# EAGLE design interruptorcontrolado (EAGLE 7.4.0)
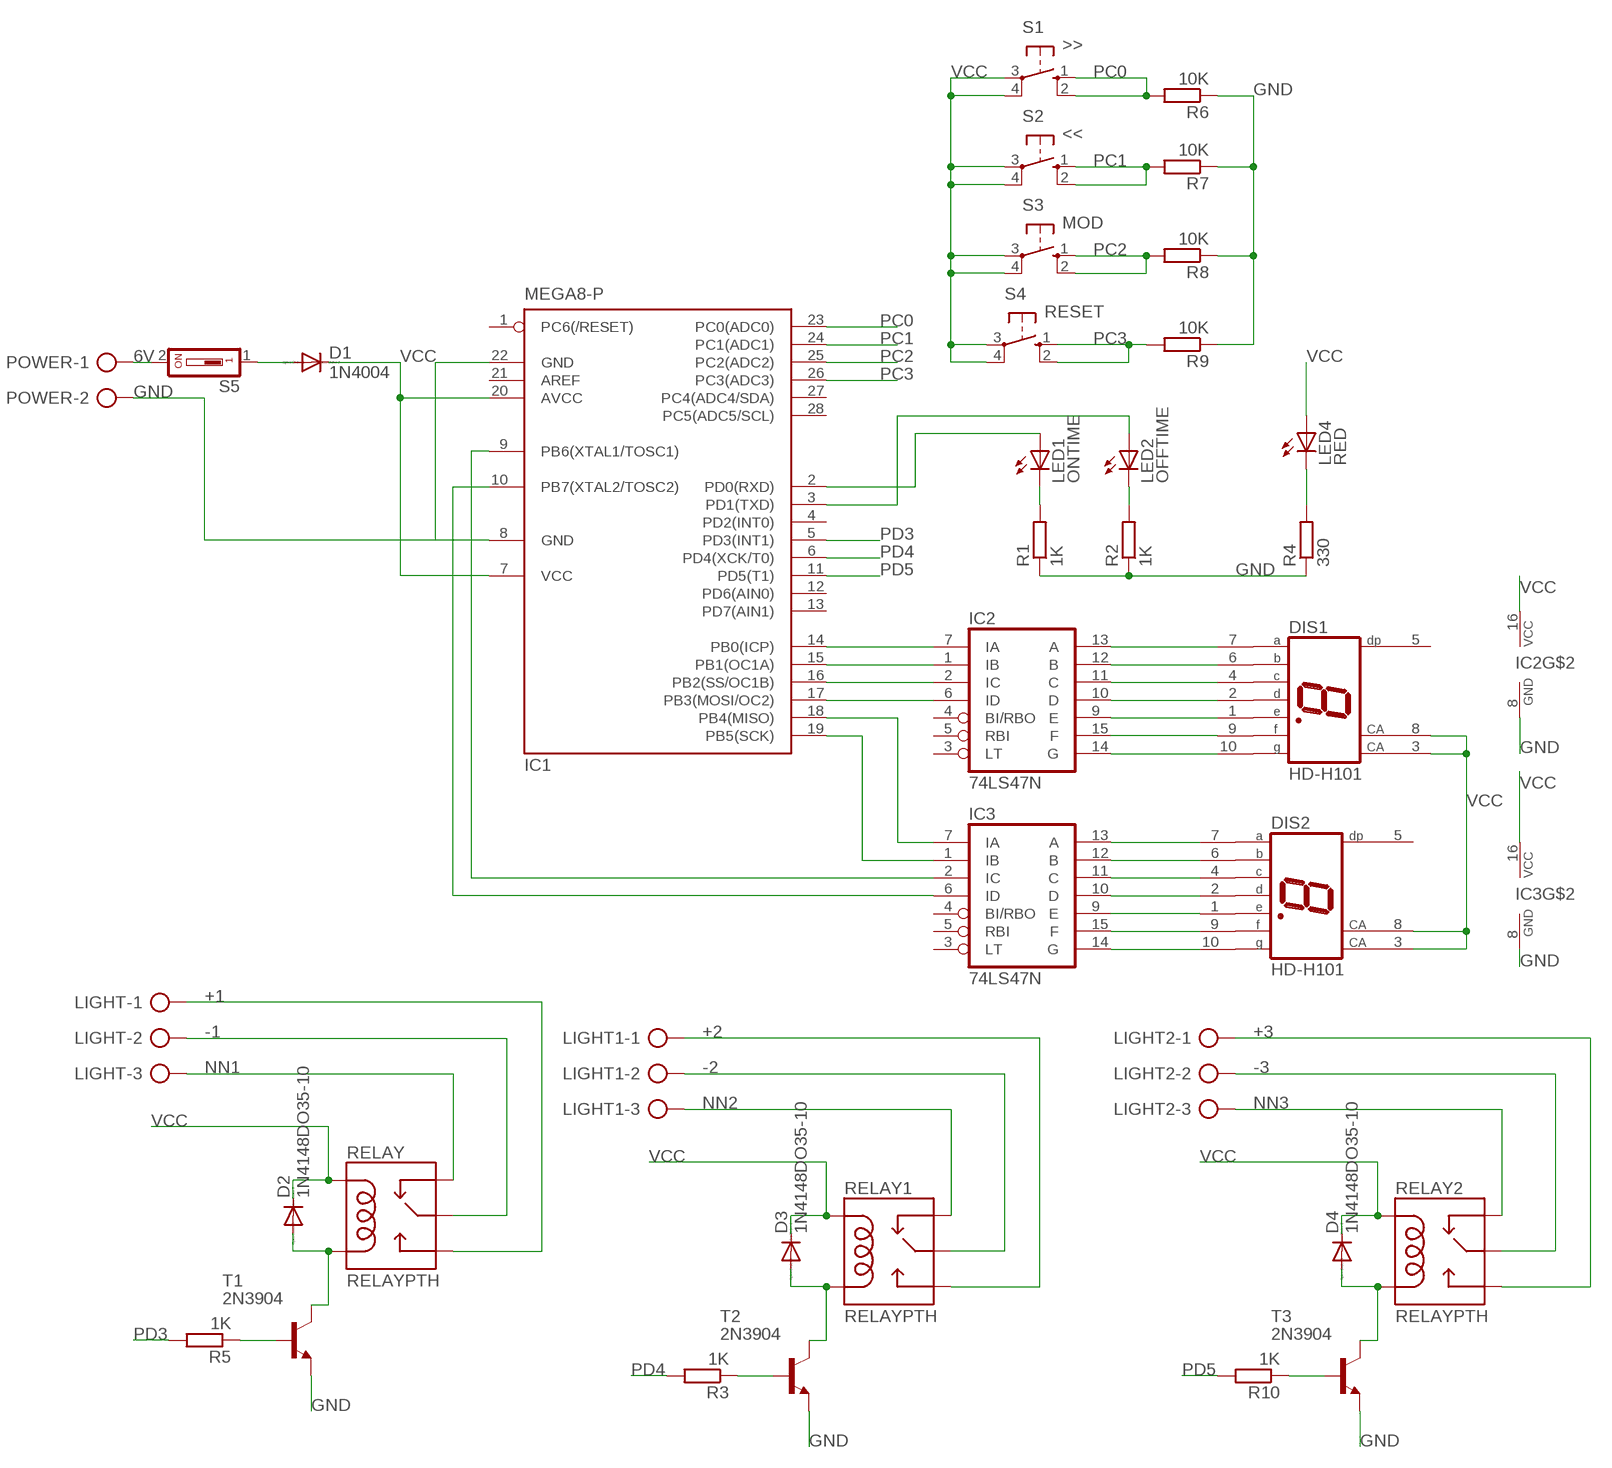
[diagram p0: schematic, sheet 1]

## Parts
D1  1N4004  [DO41-10]
D2  1N4148DO35-10  [DO35-10]
D3  1N4148DO35-10  [DO35-10]
D4  1N4148DO35-10  [DO35-10]
DIS1  HD-H101  [HDSP-M]
DIS2  HD-H101  [HDSP-M]
IC1  MEGA8-P  [DIL28-3]
IC2  74LS47N  [DIL16]
IC3  74LS47N  [DIL16]
LED1  ONTIME  LED5MM  [LED5MM]
LED2  OFFTIME  LED5MM  [LED5MM]
LED4  RED  LED5MM  [LED5MM]
LIGHT  AK500/3  [AK500/3]
LIGHT1  AK500/3  [AK500/3]
LIGHT2  AK500/3  [AK500/3]
POWER  AK500/2  [AK500/2]
R1  1K  R-EU_0207/10  [0207/10]
R2  1K  R-EU_0207/10  [0207/10]
R3  1K  R-EU_0207/10  [0207/10]
R4  330  R-EU_0207/10  [0207/10]
R5  1K  R-EU_0207/10  [0207/10]
R6  10K  R-EU_0207/10  [0207/10]
R7  10K  R-EU_0207/10  [0207/10]
R8  10K  R-EU_0207/10  [0207/10]
R9  10K  R-EU_0207/10  [0207/10]
R10  1K  R-EU_0207/10  [0207/10]
RELAY  RELAYPTH  [SRD-05VDC-SL-C]
RELAY1  RELAYPTH  [SRD-05VDC-SL-C]
RELAY2  RELAYPTH  [SRD-05VDC-SL-C]
S1  >>  10-XX  [B3F-10XX]
S2  <<  10-XX  [B3F-10XX]
S3  MOD  10-XX  [B3F-10XX]
S4  RESET  10-XX  [B3F-10XX]
S5  SD4-01  [SD4-01]
T1  2N3904  [TO92]
T2  2N3904  [TO92]
T3  2N3904  [TO92]

## Nets
6V: POWER.1 S5.2
+1: LIGHT.1 RELAY.SWOPEN
+2: LIGHT1.1 RELAY1.SWOPEN
+3: LIGHT2.1 RELAY2.SWOPEN
-1: LIGHT.2 RELAY.SWCOMMON
-2: LIGHT1.2 RELAY1.SWCOMMON
-3: LIGHT2.2 RELAY2.SWCOMMON
GND: IC1.8(GND) IC1.22(GND) IC2.8(GND) IC3.8(GND) POWER.2 R1.1 R2.1 R4.1 R6.1 R7.1 R8.1 R9.1 T1.3(E) T2.3(E) T3.3(E)
N$1: IC1.14(PB0(ICP)) IC2.7(IA)
N$2: IC1.15(PB1(OC1A)) IC2.1(IB)
N$3: IC1.16(PB2(SS/OC1B)) IC2.2(IC)
N$4: IC1.17(PB3(MOSI/OC2)) IC2.6(ID)
N$5: IC1.18(PB4(MISO)) IC3.7(IA)
N$6: IC1.19(PB5(SCK)) IC3.1(IB)
N$7: IC1.9(PB6(XTAL1/TOSC1)) IC3.2(IC)
N$8: IC1.10(PB7(XTAL2/TOSC2)) IC3.6(ID)
N$9: DIS1.7(A) IC2.13(A)
N$10: DIS1.6(B) IC2.12(B)
N$11: DIS1.4(C) IC2.11(C)
N$12: DIS1.2(D) IC2.10(D)
N$13: DIS1.1(E) IC2.9(E)
N$14: DIS1.9(F) IC2.15(F)
N$15: DIS1.10(G) IC2.14(G)
N$16: DIS2.7(A) IC3.13(A)
N$17: DIS2.6(B) IC3.12(B)
N$18: DIS2.4(C) IC3.11(C)
N$19: DIS2.2(D) IC3.10(D)
N$20: DIS2.1(E) IC3.9(E)
N$21: DIS2.9(F) IC3.15(F)
N$22: DIS2.10(G) IC3.14(G)
N$23: LED1.K(C) R1.2
N$24: LED2.K(C) R2.2
N$25: R3.1 T2.2(B)
N$26: LED4.K(C) R4.2
N$27: IC1.2(PD0(RXD)) LED1.A
N$28: IC1.3(PD1(TXD)) LED2.A
N$29: D3.A RELAY1.COIL0 T2.1(C)
N$30: R5.1 T1.2(B)
N$31: D2.A RELAY.COIL0 T1.1(C)
N$32: R10.1 T3.2(B)
N$33: D1.A S5.1
N$34: D4.A RELAY2.COIL0 T3.1(C)
NN1: LIGHT.3 RELAY.SWCLOSED(SWCLOSE)
NN2: LIGHT1.3 RELAY1.SWCLOSED(SWCLOSE)
NN3: LIGHT2.3 RELAY2.SWCLOSED(SWCLOSE)
PC0: IC1.23(PC0(ADC0)) R6.2 S1.1(S) S1.2(S1)
PC1: IC1.24(PC1(ADC1)) R7.2 S2.1(S) S2.2(S1)
PC2: IC1.25(PC2(ADC2)) R8.2 S3.1(S) S3.2(S1)
PC3: IC1.26(PC3(ADC3)) R9.2 S4.1(S) S4.2(S1)
PD3: IC1.5(PD3(INT1)) R5.2
PD4: IC1.6(PD4(XCK/T0)) R3.2
PD5: IC1.11(PD5(T1)) R10.2
VCC: D1.C D2.C D3.C D4.C DIS1.3(CA) DIS1.8(CA) DIS2.3(CA) DIS2.8(CA) IC1.7(VCC) IC1.20(AVCC) IC2.16(VCC) IC3.16(VCC) LED4.A RELAY1.COIL1 RELAY2.COIL1 RELAY.COIL1 S1.3(P) S1.4(P1) S2.3(P) S2.4(P1) S3.3(P) S3.4(P1) S4.3(P) S4.4(P1)
Unconnected: DIS1.5(DP) DIS2.5(DP) IC1.1(PC6(/RESET)) IC1.4(PD2(INT0)) IC1.12(PD6(AIN0)) IC1.13(PD7(AIN1)) IC1.21(AREF) IC1.27(PC4(ADC4/SDA)) IC1.28(PC5(ADC5/SCL)) IC2.3(LT) IC2.4(BI/RBO) IC2.5(RBI) IC3.3(LT) IC3.4(BI/RBO) IC3.5(RBI)

## Library data of the parts
D1 = diode:1N4004: DIODE general purpose rectifier, 1 A
D2-D4 = diode:1N4148: DIODE high speed (Philips)
DIS1 DIS2 = display-hp:HD-H101: LED DISPLAY 1-character 7 segment, decimal point right; OC_FARNELL: unknown; OC_NEWARK: unknown
IC1 = atmel:MEGA8-P: MICROCONTROLLER 8 Kbytes FLASH, 1 kbytes SRAM, 512 bytes EEPROM, USART, 4-channel 10 bit ADC, 2-channel 8 bit ADC Pin compatible with Atmega48, ATMega88, ATMega168 Source: avr.lbr; OC_FARNELL: unknown; OC_NEWARK: unknown
IC2 IC3 = 74xx-eu:74*47: BCD to seven segment DECODER/DRIVER Source: http://www.ee.washington.edu/stores/DataSheets/74ls/74ls47.pdf
LED1 LED2 LED4 = led:LED: LED OSRAM: - CHIPLED LG R971, LG N971, LY N971, LG Q971, LY Q971, LO R971, LY R971 LH N974, LH R974 LS Q976, LO Q976, LY Q976 LO Q996 - Hyper CHIPLED LW Q18S LB Q993, LB Q99A, LB R99A - SideLED LS A670, LO A670, LY A670, LG A670, LP A670 LB A673, LV A673, LT A673, LW A673 LH A674 LY A675 LS A676, LA A676, LO A676, LY A676, LW A676 LS A679, LY A679, LG A679 - Hyper Micro SIDELED® LS Y876, LA Y876, LO Y876, LY Y876 LT Y87S - SmartLED LW L88C, LW L88S LB L89C, LB L89S, LG L890 LS L89K, LO L89K, LY L89K LS L896, LA L896, LO L896, LY L896 - TOPLED LS T670, LO T670, LY T670, LG T670, LP T670 LSG T670, LSP T670, LSY T670, LOP T670, LYG T670 LG T671, LOG T671, LSG T671 LB T673, LV T673, LT T673, LW T673 LH T674 LS T676, LA T676, LO T676, LY T676, LB T676, LH T676, LSB T676, LW T676 LB T67C, LV T67C, LT T67C, LS T67K, LO T67K, LY T67K, LW E67C LS E67B, LA E67B, LO E67B, LY E67B, LB E67C, LV E67C, LT E67C LW T67C LS T679, LY T679, LG T679 LS T770, LO T770, LY T770, LG T770, LP T770 LB T773, LV T773, LT T773, LW T773 LH T774 LS E675, LA E675, LY E675, LS T675 LS T776, LA T776, LO T776, LY T776, LB T776 LHGB T686 LT T68C, LB T68C - Hyper Mini TOPLED® LB M676 - Mini TOPLED Santana® LG M470 LS M47K, LO M47K, LY M47K Source: http://www.osram.convergy.de LUXEON: - LUMILED® LXK2-PW12-R00, LXK2-PW12-S00, LXK2-PW14-U00, LXK2-PW14-V00 LXK2-PM12-R00, LXK2-PM12-S00, LXK2-PM14-U00 LXK2-PE12-Q00, LXK2-PE12-R00, LXK2-PE12-S00, LXK2-PE14-T00, LXK2-PE14-U00 LXK2-PB12-K00, LXK2-PB12-L00, LXK2-PB12-M00, LXK2-PB14-N00, LXK2-PB14-P00, LXK2-PB14-Q00 LXK2-PR12-L00, LXK2-PR12-M00, LXK2-PR14-Q00, LXK2-PR14-R00 LXK2-PD12-Q00, LXK2-PD12-R00, LXK2-PD12-S00 LXK2-PH12-R00, LXK2-PH12-S00 LXK2-PL12-P00, LXK2-PL12-Q00, LXK2-PL12-R00 Source: www.luxeon.com KINGBRIGHT: KA-3528ASYC Source: www.kingbright.com
LIGHT LIGHT1 LIGHT2 = con-ptr500:AK500/3: CONNECTOR; OC_FARNELL: unknown; OC_NEWARK: unknown
POWER = con-ptr500:AK500/2: CONNECTOR; OC_FARNELL: unknown; OC_NEWARK: unknown
R1-R10 = resistor:R-EU_: RESISTOR, European symbol
RELAY RELAY1 RELAY2 = RELAYino:RELAY: SPDT relay (COM-00101)
S1-S4 = switch-omron:10-XX: OMRON SWITCH; MPN: B3F-1000; OC_FARNELL: 176432; OC_NEWARK: 36M3542
S5 = switch-dil:SD4-01: DIL/CODE SWITCH; OC_FARNELL: unknown; OC_NEWARK: unknown
T1-T3 = transistor:2N3904: NPN TRANSISTOR

## Board
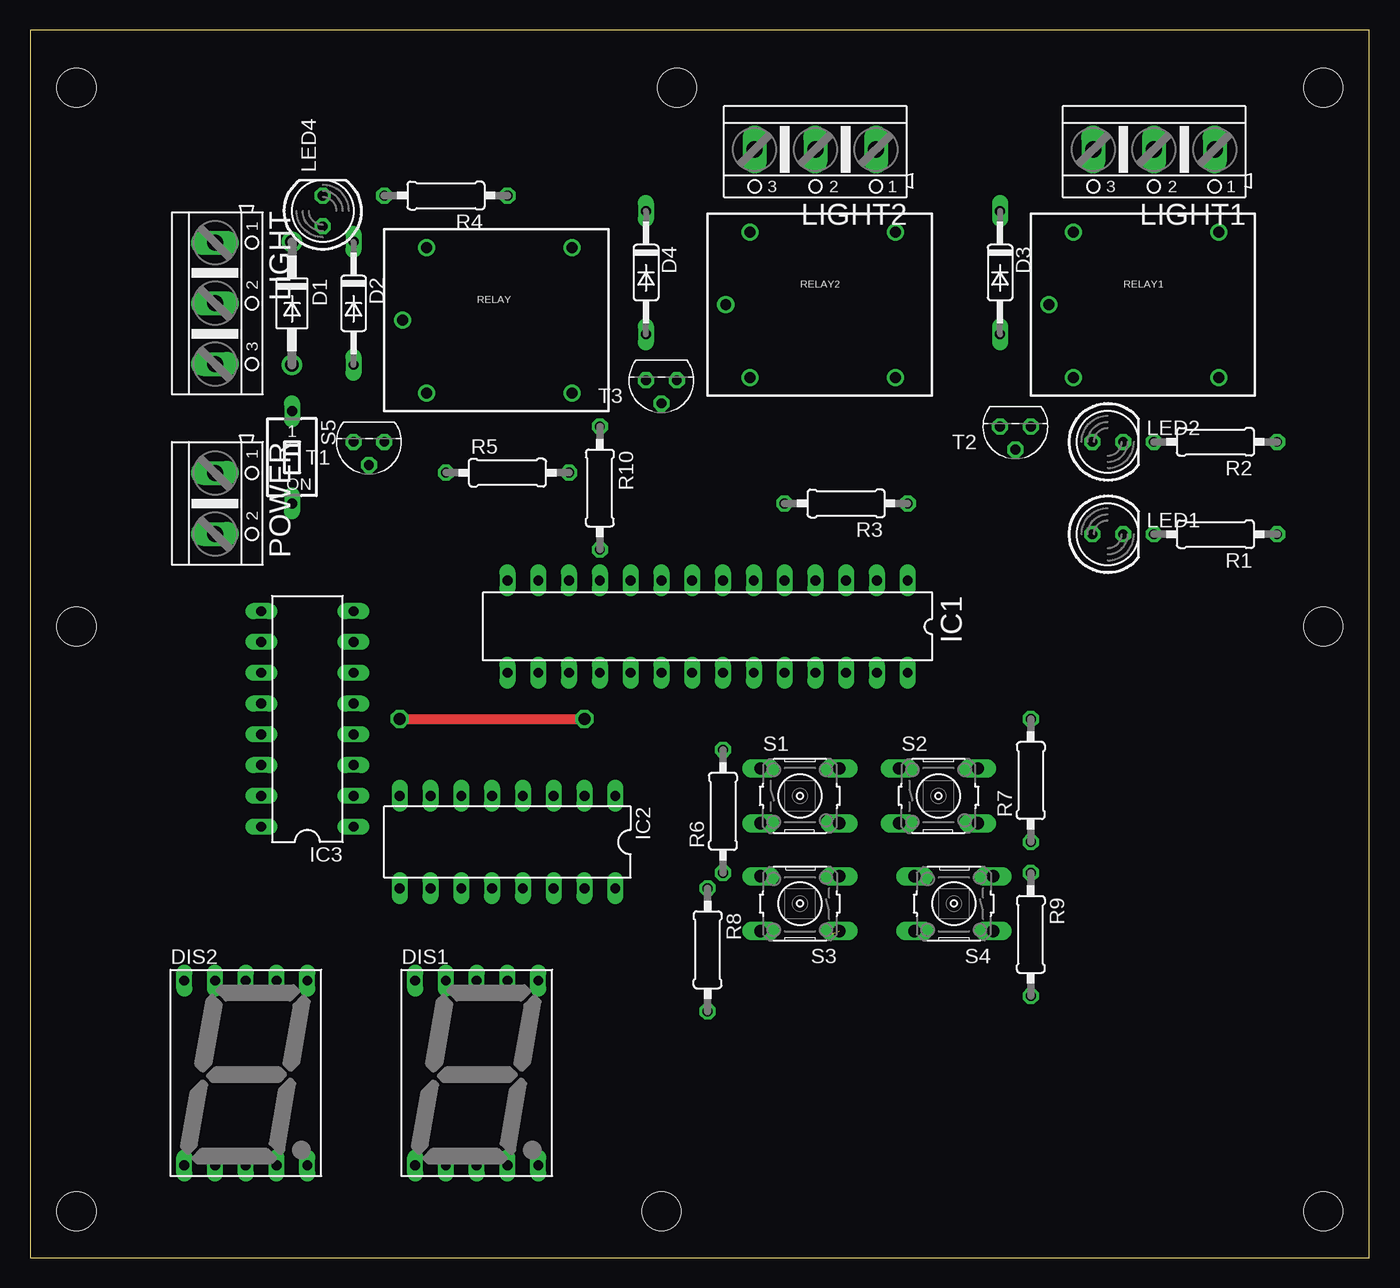
[diagram p1: board, top side]
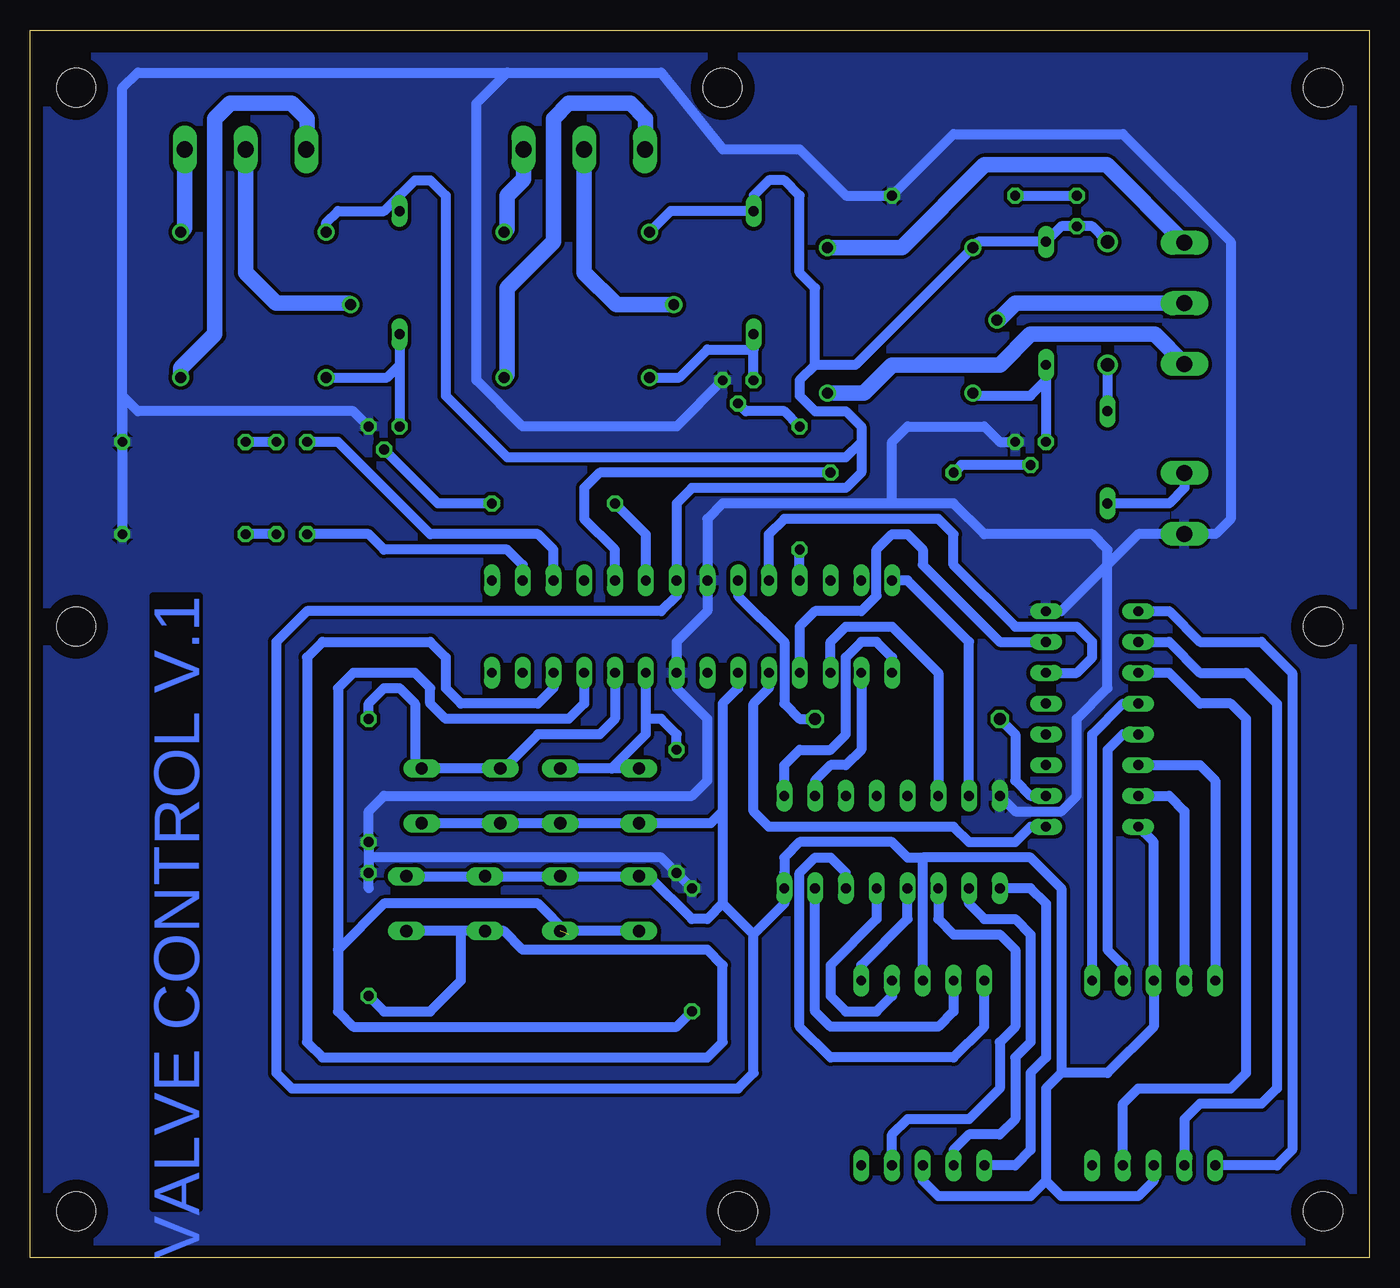
[diagram p2: board, bottom side, seen from below]

Size 110.47 x 101.27 mm. Coordinates in mm from the lower left corner, seen from the top.
Outline: 0,0 110.47,0 110.47,101.27 0,101.27 0,0
Copper layers (1*16): Top 0.035mm / dielectric 1.5mm / Bottom 0.035mm
Design rules "default *": minimum track width 10mil, minimum drill 24mil, track to track 12mil, track to pad 8mil, pad to pad 8mil, via to via 12mil, smd to smd 8mil, copper to edge 40mil, drill to drill 8mil, minimum pad ring 10mil, minimum via ring 8mil, stop-mask expansion 4mil, vias tented up to drill 0mil, thermal gap 10mil
Holes 3.2 mm at 3.81,96.52 106.68,96.52 53.34,96.52 3.81,3.81 52.07,3.81 106.68,3.81 3.81,52.07 106.68,52.07

### Footprints (pad centres in the part's own frame; a part is rotated, then mirrored left to right if it is on the bottom)
DO41-10 = drill 1.118: A 5.08,0; C -5.08,0
DO35-10 = drill 0.813 long: A 5.08,0; C -5.08,0
HDSP-M = drill 0.813 long: 1 -5.08,-7.62; 2 -2.54,-7.62; 3 0,-7.62; 4 2.54,-7.62; 5 5.08,-7.62; 6 5.08,7.62; 7 2.54,7.62; 8 0,7.62; 9 -2.54,7.62; 10 -5.08,7.62
DIL28-3 = drill 0.813 long: 1 -16.51,-3.81; 2 -13.97,-3.81; 3 -11.43,-3.81; 4 -8.89,-3.81; 5 -6.35,-3.81; 6 -3.81,-3.81; 7 -1.27,-3.81; 8 1.27,-3.81; 9 3.81,-3.81; 10 6.35,-3.81; 11 8.89,-3.81; 12 11.43,-3.81; 13 13.97,-3.81; 14 16.51,-3.81; 15 16.51,3.81; 16 13.97,3.81; 17 11.43,3.81; 18 8.89,3.81; 19 6.35,3.81; 20 3.81,3.81; 21 1.27,3.81; 22 -1.27,3.81; 23 -3.81,3.81; 24 -6.35,3.81; 25 -8.89,3.81; 26 -11.43,3.81; 27 -13.97,3.81; 28 -16.51,3.81
DIL16 = drill 0.813 long: 1 -8.89,-3.81; 2 -6.35,-3.81; 3 -3.81,-3.81; 4 -1.27,-3.81; 5 1.27,-3.81; 6 3.81,-3.81; 7 6.35,-3.81; 8 8.89,-3.81; 9 8.89,3.81; 10 6.35,3.81; 11 3.81,3.81; 12 1.27,3.81; 13 -1.27,3.81; 14 -3.81,3.81; 15 -6.35,3.81; 16 -8.89,3.81
LED5MM = drill 0.813 octagon: A -1.27,0; K 1.27,0
AK500/3 = drill 1.321 long: 1 -5.004,0; 2 0,0; 3 5.004,0
AK500/2 = drill 1.321 long: 1 -2.515,0; 2 2.515,0
0207/10 = drill 0.813 octagon: 1 -5.08,0; 2 5.08,0
SRD-05VDC-SL-C = drill 0.9: COIL0 -5.39,-6.12; COIL1 -5.39,5.88; SWCLOSED 6.61,-6.12; SWCOMMON -7.39,-0.12; SWOPEN 6.61,5.88
B3F-10XX = drill 1.016 long: 1 -3.251,2.261; 2 3.251,2.261; 3 -3.251,-2.261; 4 3.251,-2.261
SD4-01 = drill 0.813 long: 1 0,-3.81; 2 0,3.81
TO92 = drill 0.813 octagon: 1 1.27,0; 2 0,1.905; 3 -1.27,0

### Placement (x,y rotation side)
D1  21.59,78.74 270 top
D2  26.67,78.74 270 top
D3  80.01,81.28 270 top
D4  50.8,81.28 270 top
DIS1  36.83,15.24 0 top
DIS2  17.78,15.24 0 top
IC1  55.88,52.07 180 top
IC2  39.37,34.29 180 top
IC3  22.86,44.45 90 top
LED1  88.9,59.69 0 top
LED2  88.9,67.31 0 top
LED4  24.13,86.36 90 top
LIGHT  15.24,78.74 270 top
LIGHT1  92.71,91.44 180 top
LIGHT2  64.77,91.44 180 top
POWER  15.24,62.23 270 top
R1  97.79,59.69 180 top
R2  97.79,67.31 180 top
R3  67.31,62.23 180 top
R4  34.29,87.63 180 top
R5  39.37,64.77 0 top
R6  57.15,36.83 90 top
R7  82.55,39.37 90 top
R8  55.88,25.4 270 top
R9  82.55,26.67 270 top
R10  46.99,63.5 270 top
RELAY  38.1,77.47 0 top
RELAY1  91.44,78.74 0 top
RELAY2  64.77,78.74 0 top
S1  63.5,38.1 0 top
S2  74.93,38.1 0 top
S3  63.5,29.21 180 top
S4  76.2,29.21 180 top
S5  21.59,66.04 180 top
T1  27.94,67.31 180 top
T2  81.28,68.58 180 top
T3  52.07,72.39 180 top

### Tracks (layer width: path | path; a pad name or v marks a point on that pad's centre or on a via)
6V
  Bottom 0.813: POWER.1 15.24,63.5 16.51,62.23 S5.2
+1
  Bottom 1.27: LIGHT.1 21.67,90.17 31.75,90.17 38.57,83.35 RELAY.SWOPEN
+2
  Bottom 1.27: LIGHT1.1 97.71,84.96 RELAY1.SWOPEN
+3
  Bottom 1.27: LIGHT2.1 69.77,88.98 71.12,87.63 71.12,84.88 RELAY2.SWOPEN
-1
  Bottom 1.27: LIGHT.2 29.21,78.74 30.6,77.35 RELAY.SWCOMMON
-2
  Bottom 1.27: LIGHT1.2 92.71,81.28 90.17,78.74 84.17,78.74 RELAY1.SWCOMMON
-3
  Bottom 1.27: RELAY2.SWCOMMON 62.11,78.62 64.77,81.28 LIGHT2.2
GND
  Bottom 0.813: R2.1 R1.1 | 39.37,62.23 39.37,67.31 38.1,68.58 31.75,68.58 30.48,67.31 T1.3 | 82.55,33.02 R7.1 82.55,36.83 81.28,38.1 55.88,38.1 54.61,39.37 54.61,44.45 57.15,46.99 IC1.22 57.15,50.8 54.61,53.34 IC1.8 54.61,60.96 53.34,62.23 39.37,62.23 | 82.55,33.02 R9.1 82.55,30.48 | R8.1 R6.1 58.42,33.02 82.55,33.02 | 21.59,57.15 25.4,53.34 IC3.8 | IC2.8 29.21,36.83 25.4,36.83 24.13,38.1 24.13,44.45 21.59,46.99 21.59,57.15 | 21.59,57.15 19.05,59.69 15.27,59.69 POWER.2 12.68,59.72 11.43,60.96 11.43,83.82 20.32,92.71 34.29,92.71 R4.1 43.18,87.63 46.99,91.44 53.34,91.44 58.42,97.79 71.12,97.79 | 21.59,57.15 21.59,58.42 22.86,59.69 31.75,59.69 34.29,62.23 39.37,62.23 | T2.3 83.82,69.85 101.6,69.85 102.87,71.12 R2.1 | R2.1 102.87,96.52 101.6,97.79 71.12,97.79 | T3.3 57.15,68.58 69.85,68.58 73.66,72.39 73.66,95.25 71.12,97.79
  pour Bottom: 1.27,99.06 1.27,1.27 109.22,1.27 109.22,99.06
N$1
  Bottom 0.813: IC2.7 33.02,50.8 38.1,55.88 IC1.14
N$2
  Bottom 0.813: IC1.15 39.37,49.53 40.64,50.8 41.91,50.8 43.18,49.53 43.18,43.18 44.45,41.91 46.99,41.91 48.26,40.64 IC2.1
N$3
  Bottom 0.813: IC1.16 41.91,41.91 43.18,40.64 44.45,40.64 45.72,39.37 IC2.2
N$4
  Bottom 0.813: IC1.17 44.45,50.8 43.18,52.07 39.37,52.07 35.56,48.26 IC2.6
N$5
  Bottom 0.813: IC3.7 30.48,50.8 36.83,57.15 36.83,58.42 38.1,59.69 39.37,59.69 40.64,58.42 40.64,54.61 41.91,53.34 45.72,53.34 46.99,52.07 IC1.18
N$6
  Bottom 0.813: IC3.1 27.94,35.56 29.21,34.29 33.02,34.29 34.29,35.56 49.53,35.56 50.8,36.83 50.8,45.72 49.53,46.99 IC1.19
N$7  (via drill 1)
  Top 0.813: v30.48,44.45 v45.72,44.45
  Bottom 0.813: v30.48,44.45 29.21,43.18 29.21,39.37 27.94,38.1 IC3.2 | IC1.9 52.07,54.61 48.26,50.8 48.26,45.72 46.99,44.45 v45.72,44.45
N$8
  Bottom 0.813: IC1.10 49.53,59.69 48.26,60.96 35.56,60.96 34.29,59.69 34.29,57.15 29.21,52.07 24.13,52.07 22.86,50.8 22.86,49.53 24.13,48.26 IC3.6
N$9
  Bottom 0.813: DIS1.7 39.37,21.59 40.64,20.32 43.18,20.32 44.45,21.59 44.45,24.13 40.64,27.94 IC2.13
N$10
  Bottom 0.813: DIS1.6 41.91,24.13 38.1,27.94 IC2.12
N$11
  Bottom 0.813: IC2.11 35.56,27.94 34.29,26.67 30.48,26.67 29.21,25.4 29.21,19.05 30.48,17.78 30.48,13.97 33.02,11.43 38.1,11.43 39.37,10.16 DIS1.4
N$12
  Bottom 0.813: IC2.10 33.02,29.21 31.75,27.94 29.21,27.94 27.94,26.67 27.94,17.78 29.21,16.51 29.21,11.43 30.48,10.16 33.02,10.16 34.29,8.89 DIS1.2
N$13
  Bottom 0.813: IC2.9 27.94,30.48 26.67,29.21 26.67,16.51 27.94,15.24 27.94,8.89 29.21,7.62 DIS1.1
N$14
  Bottom 0.813: IC2.15 45.72,20.32 44.45,19.05 35.56,19.05 34.29,20.32 DIS1.9
N$15
  Bottom 0.813: IC2.14 43.18,31.75 44.45,33.02 45.72,33.02 46.99,31.75 46.99,19.05 44.45,16.51 34.29,16.51 31.75,19.05 DIS1.10
N$16
  Bottom 0.813: IC3.13 20.32,43.18 21.59,41.91 21.59,25.4 20.32,24.13 DIS2.7
N$17
  Bottom 0.813: DIS2.6 22.86,43.18 20.32,45.72 IC3.12
N$18
  Bottom 0.813: DIS2.4 20.32,12.7 19.05,13.97 11.43,13.97 10.16,15.24 10.16,44.45 11.43,45.72 13.97,45.72 16.51,48.26 IC3.11
N$19
  Bottom 0.813: IC3.10 16.51,50.8 13.97,48.26 10.16,48.26 7.62,45.72 7.62,13.97 8.89,12.7 13.97,12.7 15.24,11.43 DIS2.2
N$20
  Bottom 0.813: IC3.9 16.51,53.34 13.97,50.8 8.89,50.8 6.35,48.26 6.35,8.89 7.62,7.62 DIS2.1
N$21
  Bottom 0.813: IC3.15 16.51,38.1 15.24,36.83 DIS2.9
N$22
  Bottom 0.813: IC3.14 13.97,40.64 12.7,39.37 DIS2.10
N$23
  Bottom 0.813: LED1.K R1.2
N$24
  Bottom 0.813: LED2.K R2.2
N$25
  Bottom 0.813: R3.1 76.83,62.23 T2.2
N$26
  Bottom 0.813: R4.2 LED4.K
N$27
  Bottom 0.813: IC1.2 69.85,57.15 71.12,58.42 81.28,58.42 82.55,59.69 LED1.A
N$28
  Bottom 0.813: IC1.3 67.31,58.42 68.58,59.69 77.47,59.69 85.09,67.31 LED2.A
N$29
  Bottom 0.813: D3.A 80.01,73.66 | 80.01,73.66 T2.1 | RELAY1.COIL0 81.05,72.62 80.01,73.66
N$30
  Bottom 0.813: T1.2 33.66,65.41 R5.1
N$31
  Bottom 0.813: D2.A 26.67,72.39 | 26.67,72.39 T1.1 | RELAY.COIL0 32.48,71.12 27.94,71.12 26.67,72.39
N$32
  Bottom 0.813: R10.1 48.26,69.85 51.44,69.85 T3.2
N$33
  Bottom 0.813: D1.A S5.1
N$34
  Bottom 0.813: T3.1 50.8,74.93 | 50.8,74.93 D4.A | RELAY2.COIL0 56.92,72.62 54.61,74.93 50.8,74.93
NN1
  Bottom 1.27: LIGHT.3 17.7,76.2 27.94,76.2 30.48,73.66 39.37,73.66 41.68,71.35 RELAY.SWCLOSED
NN2
  Bottom 1.27: RELAY1.SWCLOSED 98.05,73.4 95.25,76.2 95.25,93.98 93.98,95.25 88.9,95.25 87.63,93.98 87.63,91.52 LIGHT1.3
NN3
  Bottom 1.27: LIGHT2.3 59.77,91.36 | RELAY2.SWCLOSED 71.12,72.88 71.12,80.01 67.31,83.82 67.31,93.98 66.04,95.25 60.96,95.25 59.69,93.98 59.69,91.52 LIGHT2.3 | LIGHT2.3 59.77,92.79
PC0
  Bottom 0.813: S1.1 62.51,40.36 | IC1.23 59.69,44.45 | 59.69,44.45 59.69,43.18 62.51,40.36 | 62.51,40.36 S1.2 | R6.2 57.15,43.18 58.42,44.45 59.69,44.45
PC1
  Bottom 0.813: 82.27,44.45 R7.2 82.55,45.72 81.28,46.99 80.01,46.99 78.74,45.72 78.74,40.92 S2.2 S2.1 71.4,40.36 68.58,43.18 63.5,43.18 62.23,44.45 IC1.24
PC2  (1 unrouted)
  Bottom 0.813: IC1.25 64.77,45.72 66.04,44.45 76.2,44.45 77.47,45.72 77.47,46.99 78.74,48.26 83.82,48.26 85.09,46.99 85.09,25.4 | 85.09,25.4 85.09,20.32 83.82,19.05 57.15,19.05 R8.2 | S3.1 S3.2 60.53,26.67 | 66.04,26.67 68.58,29.21 81.28,29.21 85.09,25.4
PC3
  Bottom 0.813: S4.2 74.93,26.95 | 74.93,26.95 S4.1 | S4.2 72.67,26.67 72.39,26.67 | IC1.26 67.31,46.99 68.58,45.72 74.93,45.72 76.2,46.99 76.2,49.53 77.47,50.8 86.36,50.8 87.63,49.53 87.63,17.78 86.36,16.51 54.61,16.51 53.34,17.78 53.34,24.13 54.61,25.4 69.85,25.4 71.4,26.95 S4.2 | R9.2 81.28,20.32 77.47,20.32 74.93,22.86 74.93,26.95
PD3
  Bottom 0.813: IC1.5 62.23,58.42 64.77,60.96 64.77,63.5 63.5,64.77 R5.2
PD4
  Bottom 0.813: R3.2 59.69,59.69 IC1.6
PD5
  Bottom 0.813: IC1.11 R10.2
VCC
  Bottom 0.813: D1.C 22.86,85.09 LED4.A 25.4,85.09 D2.C 32.24,83.82 RELAY.COIL1 42.4,73.66 45.72,73.66 | 45.72,73.66 46.99,72.39 46.99,71.12 45.72,69.85 43.18,69.85 41.91,68.58 41.91,67.31 | S2.4 S2.3 S1.4 S1.3 54.33,35.84 53.34,36.83 | 25.4,15.24 21.59,15.24 17.78,19.05 DIS2.8 17.78,34.29 IC3.16 | 25.4,15.24 26.67,13.97 26.67,6.35 | 26.67,6.35 25.4,5.08 19.05,5.08 17.78,6.35 DIS2.3 | 26.67,6.35 27.94,5.08 35.56,5.08 36.83,6.35 DIS1.3 | 25.4,15.24 25.4,30.48 27.94,33.02 36.83,33.02 | 48.26,31.75 IC2.16 | DIS1.8 36.83,33.02 | 36.83,33.02 38.1,33.02 39.37,34.29 46.99,34.29 48.26,33.02 IC2.16 | S4.3 S4.4 S3.3 S3.4 59.41,31.47 55.88,27.94 54.61,27.94 53.34,29.21 | 50.8,26.67 50.8,15.24 52.07,13.97 88.9,13.97 90.17,15.24 90.17,50.8 87.63,53.34 58.42,53.34 57.15,54.61 IC1.7 57.15,62.23 55.88,63.5 43.18,63.5 41.91,64.77 41.91,67.31 | 50.8,26.67 53.34,29.21 | IC1.20 52.07,46.99 53.34,45.72 53.34,36.83 | 53.34,36.83 53.34,29.21 | 45.72,73.66 45.72,80.01 46.99,81.28 46.99,87.63 48.26,88.9 49.53,88.9 50.8,87.63 D4.C 57.64,86.36 RELAY2.COIL1 | D3.C 80.01,87.63 | 80.01,87.63 78.74,88.9 77.47,88.9 76.2,87.63 76.2,71.12 71.12,66.04 43.18,66.04 41.91,67.31 | RELAY1.COIL1 86.05,85.4 85.09,86.36 81.28,86.36 80.01,87.63 | IC2.16 48.26,29.21 50.8,26.67

### Text on the board
Bottom: VALVE CONTROL V.1